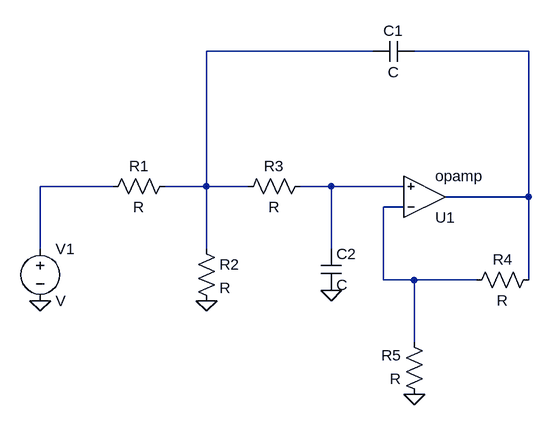
[diagram p0: schematic LTSpice Schematic Ideal OpAmp.asc]
LTSpice Schematic Ideal OpAmp.asc, the LTspice schematic file:
Version 4
SHEET 1 880 680
WIRE 544 -176 288 -176
WIRE 784 -176 608 -176
WIRE 144 32 32 32
WIRE 288 32 288 -176
WIRE 288 32 224 32
WIRE 352 32 288 32
WIRE 480 32 432 32
WIRE 592 32 480 32
WIRE 784 48 784 -176
WIRE 784 48 656 48
WIRE 592 64 560 64
WIRE 32 128 32 32
WIRE 288 128 288 32
WIRE 480 128 480 32
WIRE 560 176 560 64
WIRE 608 176 560 176
WIRE 704 176 608 176
WIRE 784 176 784 48
WIRE 608 272 608 176
FLAG 608 352 0
FLAG 480 192 0
FLAG 288 208 0
FLAG 32 208 0
SYMBOL voltage 32 112 R0
SYMATTR InstName V1
SYMBOL res 128 48 R270
WINDOW 0 32 56 VTop 2
WINDOW 3 0 56 VBottom 2
SYMATTR InstName R1
SYMBOL res 336 48 R270
WINDOW 0 32 56 VTop 2
WINDOW 3 0 56 VBottom 2
SYMATTR InstName R3
SYMBOL res 272 112 R0
SYMATTR InstName R2
SYMBOL res 800 160 R90
WINDOW 0 0 56 VBottom 2
WINDOW 3 32 56 VTop 2
SYMATTR InstName R4
SYMBOL res 624 368 R180
WINDOW 0 36 76 Left 2
WINDOW 3 36 40 Left 2
SYMATTR InstName R5
SYMBOL cap 464 128 R0
SYMATTR InstName C2
SYMBOL cap 608 -192 R90
WINDOW 0 0 32 VBottom 2
WINDOW 3 32 32 VTop 2
SYMATTR InstName C1
SYMBOL Opamps\\opamp 624 112 M180
SYMATTR InstName U1

The netlist it stands for:
* LTSpice Schematic Ideal OpAmp.asc
V1 N003 0 V
R1 N003 N001 R
R3 N001 N004 R
R2 N001 0 R
R4 N002 N005 R
R5 0 N005 R
C2 N004 0 C
C1 N002 N001 C
XU1 N005 N004 N002 opamp Aol=100K GBW=10Meg  ; pins invin noninvin out
.backanno
.end